# Altium schematic sheet Humidifier.SchDoc
size A2
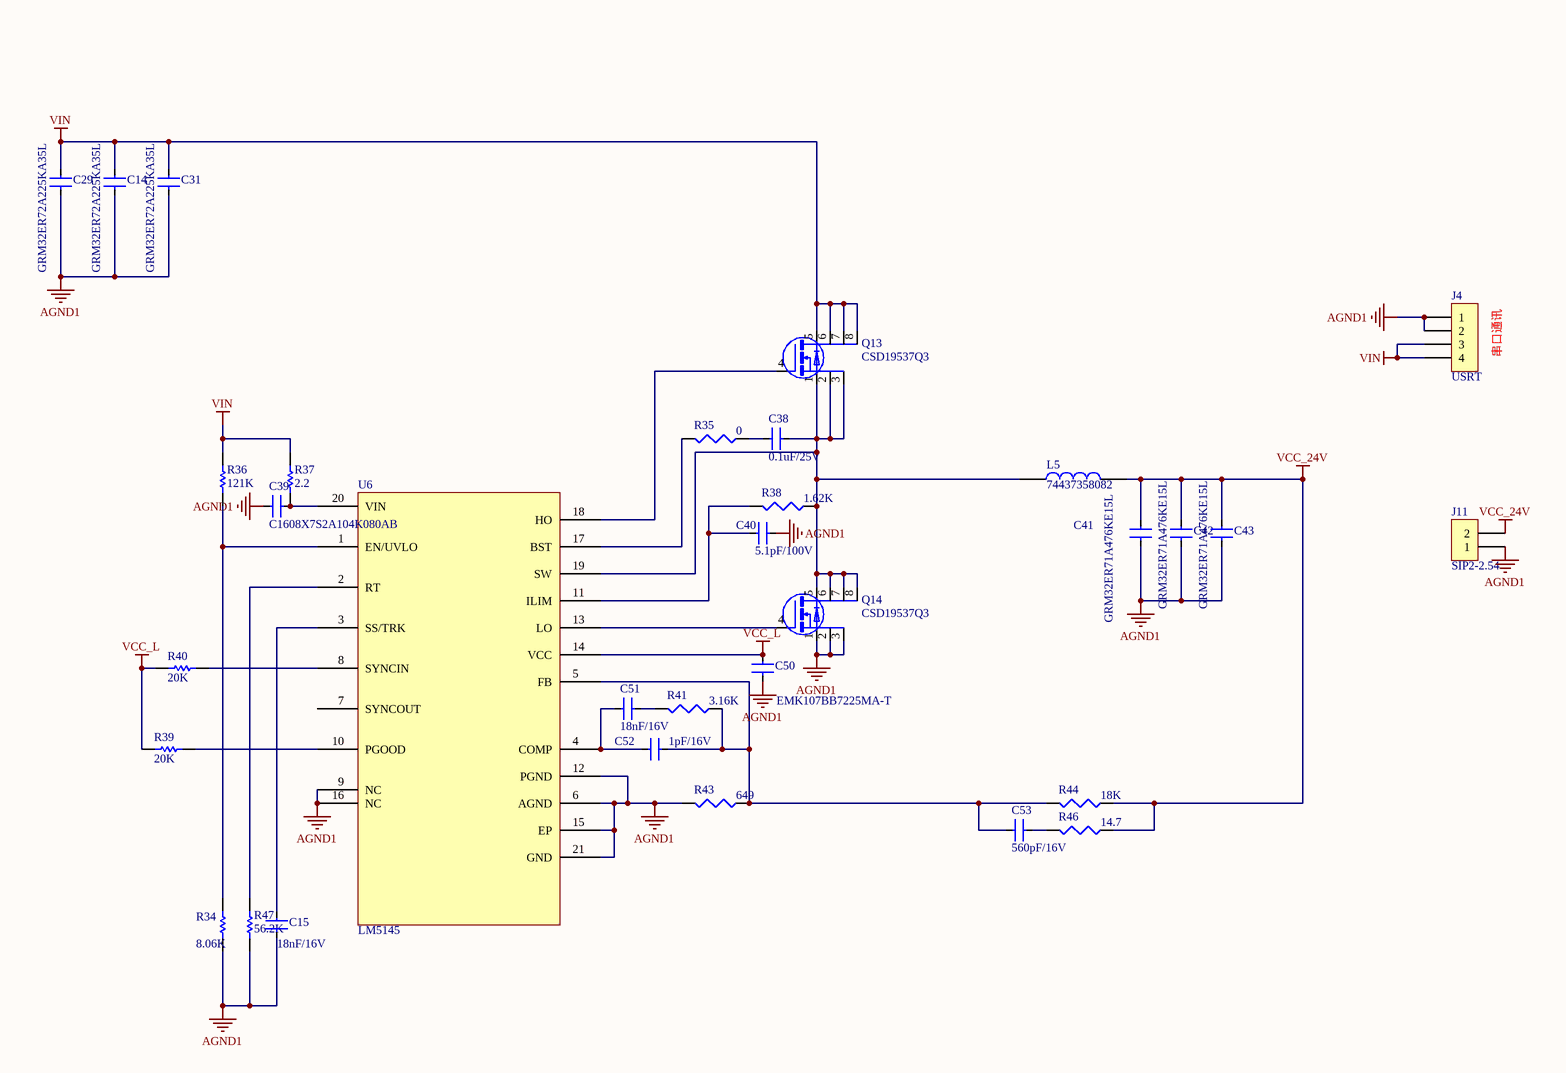
[diagram p0: Humidifier.SchDoc]

## Parts
C14  GRM32ER72A225KA35L  [1210C]
C15  18nF/16V  [0603C]
C29  GRM32ER72A225KA35L  [1210C]
C31  GRM32ER72A225KA35L  [1210C]
C38  0.1uF/25V  [0603C]
C39  C1608X7S2A104K080AB  [0603C]
C40  5.1pF/100V  [0603C]
C41  GRM32ER71A476KE15L  [1210C]
C42  GRM32ER71A476KE15L  [1210C]
C43  GRM32ER71A476KE15L  [1210C]
C50  EMK107BB7225MA-T  [0603C]
C51  18nF/16V  [0603C]
C52  1pF/16V  [0603C]
C53  560pF/16V  [0603C]
J4  USRT  [hdr1x4]
J11  SIP2-2.54  [SIP-2L]
L5  74437358082  [SRP1270-2R2M]
Q13  CSD19537Q3  [PowerPAK SO-8]
Q14  CSD19537Q3  [PowerPAK SO-8]
R34  8.06K  [0603R]
R35  0  [0603R]
R36  121K  [0805R]
R37  2.2  [0603R]
R38  1.62K  [0603R]
R39  20K  [0603R]
R40  20K  [0603R]
R41  3.16K  [0603R]
R43  649  [0603R]
R44  18K  [0603R]
R46  14.7  [0603R]
R47  56.2K  [0603R]
U6  LM5145  [QFN050P600-8N]

## Nets
AGND1: C14.2 C15.2 C29.2 C31.2 C39.1 C40.1 C41.2 C42.2 C43.2 C50.2 J4.1 J4.2 J11.1 Q14.1(S) Q14.2(S) Q14.3(S) R34.1 R43.2 R47.1 U6.6(AGND) U6.9(NC) U6.12(PGND) U6.15(EP) U6.16(NC) U6.21(GND)
VCC_24V: C41.1 C42.1 C43.1 J11.2 L5.2 R44.1 R46.1
VCC_L: C50.1 R39.2 R40.2 U6.14(VCC)
VIN: C14.1 C29.1 C31.1 J4.3 J4.4 Q13.5(D) Q13.6(D) Q13.7(D) Q13.8(D) R36.2 R37.1
NetC15_1: C15.1 U6.3(SS/TRK)
NetC38_1: C38.1 R35.1
NetC38_2: C38.2 L5.1 Q13.1(S) Q13.2(S) Q13.3(S) Q14.5(D) Q14.6(D) Q14.7(D) Q14.8(D) R38.1 U6.19(SW)
NetC39_2: C39.2 R37.2 U6.20(VIN)
NetC40_2: C40.2 R38.2 U6.11(ILIM)
NetC51_1: C51.1 C52.1 U6.4(COMP)
NetC51_2: C51.2 R41.2
NetC52_2: C52.2 C53.1 R41.1 R43.1 R44.2 U6.5(FB)
NetC53_2: C53.2 R46.2
NetQ13_4: Q13.4(G) U6.18(HO)
NetQ14_4: Q14.4(G) U6.13(LO)
NetR34_2: R34.2 R36.1 U6.1(EN/UVLO)
NetR35_2: R35.2 U6.17(BST)
NetR39_1: R39.1 U6.10(PGOOD)
NetR40_1: R40.1 U6.8(SYNCIN)
NetR47_2: R47.2 U6.2(RT)

Not connected (* = marked no-connect by the designer): U6 7(SYNCOUT)

## Notes on the sheet
- (near J4) 串口通讯

## Library data of the parts
C14 C15 C29 C31 C38-C43 C50-C53 = 0.01UF: CCX85-103
J4 = SIP4-2.54: CN-SIP4-2.54
J11 = SIP2-2.54: CN-SIP2-2.54
L5 = INDUCTOR
Q13 Q14 = Si4004DY
R34 R36 R37 R39 R40 R47 = Res Semi: Semiconductor Resistor; Value: 1K; Published: 8-Jun-2000; LatestRevisionDate: 17-Jul-2002; LatestRevisionNote: Re-released for DXP Platform.; PackageReference: AXIAL-0.5; Publisher: Altium Limited
R35 R38 R41 R43 R44 R46 = Res3: Resistor; Published: 8-Jun-2000; LatestRevisionDate: 29-May-2009; LatestRevisionNote: IPC-7351 Footprint Added.; PackageReference: J1-0603; Publisher: Altium Limited; PackageDescription: Chip Resistor